# Altium project KPT1001S.PrjPCB
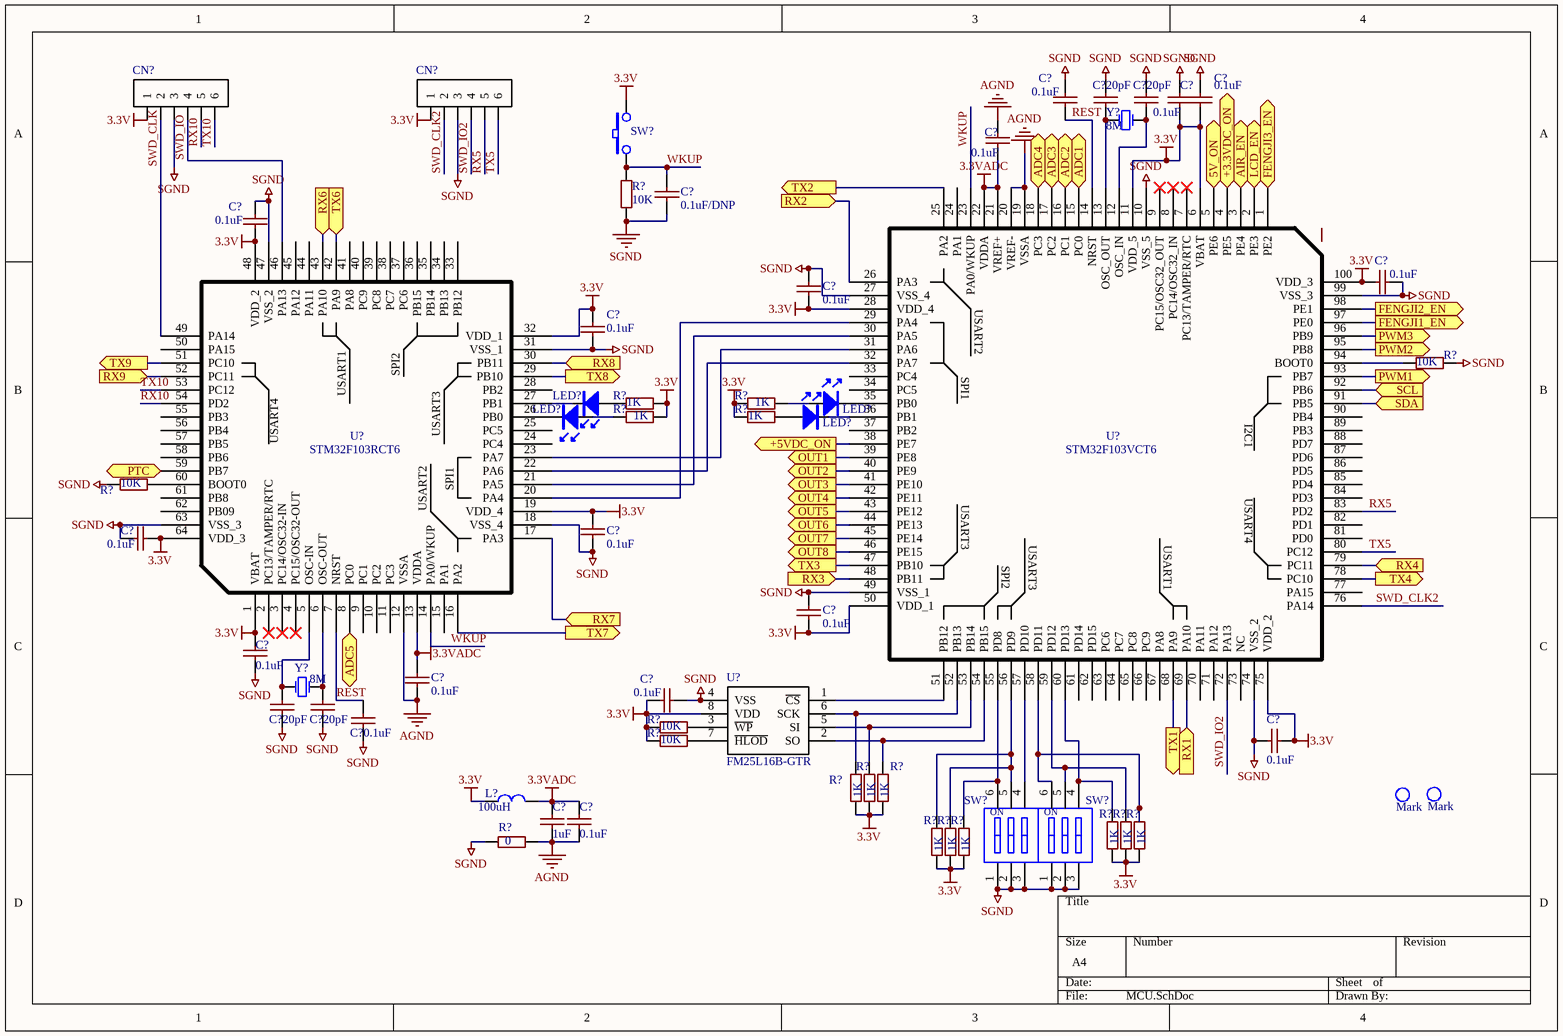
[diagram p0: MCU.SchDoc]
4 sheets, 340 parts. Net scope: flat (ports and power ports of the same name join across sheets).
Sheets:
  MCU.SchDoc
  POWER.SchDoc
  COMM.SchDoc
  OTHER.SchDoc

## Sheet MCU.SchDoc
size A4

### Parts
(Parts that share a designator on the sheet are numbered #1, #2 ... from top to bottom, then left to right.)
C?#1  0.1uF  [0603_C]
C?#2  20pF  [0603_C]
C?#3  20pF  [0603_C]
C?#4  0.1uF  [0603_C]
C?#5  0.1uF  [0603_C]
C?#6  0.1uF  [0603_C]
C?#7  0.1uF/DNP  [0603_C]
C?#8  0.1uF  [0603_C]
C?#9  0.1uF  [0603_C]
C?#10  0.1uF  [0603_C]
C?#11  0.1uF  [0603_C]
C?#12  0.1uF  [0603_C]
C?#13  0.1uF  [0603_C]
C?#14  0.1uF  [0603_C]
C?#15  0.1uF  [0603_C]
C?#16  0.1uF  [0603_C]
C?#17  0.1uF  [0603_C]
C?#18  20pF  [0603_C]
C?#19  20pF  [0603_C]
C?#20  0.1uF  [0603_C]
C?#21  0.1uF  [0603_C]
C?#22  1uF  [0603_C]
C?#23  0.1uF  [0603_C]
CN?#1  CON6  [CON6]  (value not drawn)
CN?#2  CON6  [CON6]  (value not drawn)
L?#1  100uH  [0603_L]
LED?#1  Led  [0603_LED]  (value not drawn)
LED?#2  Led  [0603_LED]  (value not drawn)
LED?#3  Led  [0603_LED]  (value not drawn)
LED?#4  Led  [0603_LED]  (value not drawn)
M?#1  Mark  [Mark]
M?#2  Mark  [Mark]
R?#1  10K  [0603_R]
R?#2  10K  [0603_R]
R?#3  1K  [0603_R]
R?#4  1K  [0603_R]
R?#5  1K  [0603_R]
R?#6  1K  [0603_R]
R?#7  10K  [0603_R]
R?#8  10K  [0603_R]
R?#9  10K  [0603_R]
R?#10  1K  [0603_R]
R?#11  1K  [0603_R]
R?#12  1K  [0603_R]
R?#13  1K  [0603_R]
R?#14  1K  [0603_R]
R?#15  1K  [0603_R]
R?#16  0  [0603_R]
R?#17  1K  [0603_R]
R?#18  1K  [0603_R]
R?#19  1K  [0603_R]
SW?#1  Button  [SW2_12x12]  (value not drawn)
SW?#2  DSHP02TSGET  [DSHP02TSGET]  (value not drawn)
SW?#3  DSHP02TSGET  [DSHP02TSGET]  (value not drawn)
U?#1  STM32F103VCT6  [LQFP100]
U?#2  STM32F103RCT6  [LQFP64]
U?#3  FM25L16B-GTR  [SO8]
Y?#1  8M  [SMD_5032_4p]
Y?#2  8M  [SMD_5032_4p]

### Ports
5V_ON (out), +3.3VDC_ON (out), +5VDC_ON (out), ADC1 (in), ADC2 (in), ADC3 (in), ADC4 (in), ADC5 (in), AIR_EN (out), FENGJI1_EN (out), FENGJI2_EN (out), FENGJI3_EN (out), LCD_EN (out), OUT1 (out), OUT2 (out), OUT3 (out), OUT4 (out), OUT5 (out), OUT6 (out), OUT7 (out), OUT8 (out), PTC (out), PWM1 (out), PWM2 (out), PWM3 (out), RX1 (in), RX2 (in), RX3 (in), RX4 (in), RX6 (in), RX7 (in), RX8 (in), RX9 (in), SCL (in), SDA (in), TX1 (out), TX2 (out), TX3 (out), TX4 (out), TX6 (in), TX7 (out), TX8 (out), TX9 (out)

### Nets
3.3V: C?#4.2 C?#5.2 C?#8.2 C?#9.2 C?#10.2 C?#11.1 C?#12.1 C?#13.2 C?#14.2 C?#15.2 C?#17.1 C?#21.1 CN?#1.1 CN?#2.1 L?#1.1 R?#3.2 R?#4.2 R?#5.2 R?#6.2 R?#8.2 R?#9.2 R?#10.1 R?#11.1 R?#12.1 R?#13.1 R?#14.1 R?#15.1 R?#17.1 R?#18.1 R?#19.1 SW?#1.2 U?#1.6(VBAT) U?#1.11(VDD_5) U?#1.28(VDD_4) U?#1.50(VDD_1) U?#1.75(VDD_2) U?#1.100(VDD_3) U?#2.1(VBAT) U?#2.19(VDD_4) U?#2.32(VDD_1) U?#2.48(VDD_2) U?#2.64(VDD_3) U?#3.8(VDD)
3.3VADC: C?#6.1 C?#16.2 C?#22.2 C?#23.2 L?#1.2 U?#1.21(VREF+) U?#1.22(VDDA) U?#2.13(VDDA)
AGND: C?#6.2 C?#16.1 C?#22.1 C?#23.1 R?#16.1 U?#1.19(VSSA) U?#1.20(VREF-) U?#2.12(VSSA)
SGND: C?#1.1 C?#2.1 C?#3.1 C?#4.1 C?#5.1 C?#7.1 C?#8.1 C?#9.1 C?#10.1 C?#11.2 C?#12.2 C?#13.1 C?#14.1 C?#15.1 C?#17.2 C?#18.2 C?#19.2 C?#20.1 C?#21.2 CN?#1.3 CN?#2.3 R?#1.2 R?#2.1 R?#7.2 R?#16.2 SW?#2.1(A1) SW?#2.2(A2) SW?#2.3(B2) SW?#3.1(A1) SW?#3.2(A2) SW?#3.3(B2) U?#1.10(VSS_5) U?#1.27(VSS_4) U?#1.49(VSS_1) U?#1.74(VSS_2) U?#1.99(VSS_3) U?#2.18(VSS_4) U?#2.31(VSS_1) U?#2.47(VSS_2) U?#2.63(VSS_3) U?#3.4(VSS)
REST: C?#1.2 C?#20.2 U?#1.14(NRST) U?#2.7(NRST)
RX5: CN?#2.5 U?#1.83(PD2)
RX10: CN?#1.5 U?#2.54(PD2)
SWD_CLK: CN?#1.2 U?#2.49(PA14)
SWD_CLK2: CN?#2.2 U?#1.76(PA14)
SWD_IO: CN?#1.4 U?#2.46(PA13)
SWD_IO2: CN?#2.4 U?#1.72(PA13)
TX5: CN?#2.6 U?#1.80(PC12)
TX10: CN?#1.6 U?#2.53(PC12)
WKUP: C?#7.2 R?#1.1 SW?#1.1 U?#1.23(PA0/WKUP) U?#2.14(PA0/WKUP)
NetC?#2_2: C?#2.2 U?#1.13(OSC_OUT) Y?#1.1(OSC1)
NetC?#3_2: C?#3.2 U?#1.12(OSC_IN) Y?#1.3(OSC2)
NetC?#18_1: C?#18.1 U?#2.5(OSC-IN) Y?#2.3(OSC2)
NetC?#19_1: C?#19.1 U?#2.6(OSC-OUT) Y?#2.1(OSC1)
NetC?#66_1: U?#1.15(PC0) ; port ADC1
NetC?#67_1: U?#1.16(PC1) ; port ADC2
NetC?#68_1: U?#1.17(PC2) ; port ADC3
NetC?#69_1: U?#1.18(PC3) ; port ADC4
NetC?#70_1: U?#2.8(PC0) ; port ADC5
NetLED?#1_A: LED?#1.A R?#4.1
NetLED?#1_K: LED?#1.K U?#1.35(PB0)
NetLED?#2_A: LED?#2.A R?#6.1
NetLED?#2_K: LED?#2.K U?#1.36(PB1)
NetLED?#3_A: LED?#3.A R?#3.1
NetLED?#3_K: LED?#3.K U?#2.27(PB1)
NetLED?#4_A: LED?#4.A R?#5.1
NetLED?#4_K: LED?#4.K U?#2.26(PB0)
NetLED?#9_K: U?#1.48(PB11) ; port RX3
NetLED?#10_K: U?#1.79(PC11) ; port RX4
NetR?#2_2: R?#2.2 U?#1.94(BOOT0)
NetR?#7_1: R?#7.1 U?#2.60(BOOT0)
NetR?#8_1: R?#8.1 U?#3.3(~{WP})
NetR?#9_1: R?#9.1 U?#3.7(~{HLOD})
NetR?#10_2: R?#10.2 U?#1.52(PB13) U?#3.6(SCK)
NetR?#11_2: R?#11.2 U?#1.53(PB14) U?#3.5(SI)
NetR?#12_2: R?#12.2 U?#1.54(PB15) U?#3.2(SO)
NetR?#13_2: R?#13.2 SW?#3.4(B1) U?#1.60(PD13)
NetR?#14_2: R?#14.2 SW?#3.5(B2) U?#1.59(PD12)
NetR?#15_2: R?#15.2 SW?#3.6(B3) U?#1.58(PD11)
NetR?#17_2: R?#17.2 R?#18.2 SW?#2.5(B2) U?#1.56(PD9)
NetR?#19_2: R?#19.2 SW?#2.6(B3) U?#1.55(PD8)
NetR?#22_1: U?#1.44(PE13) ; port OUT6
NetR?#25_1: U?#1.45(PE14) ; port OUT7
NetR?#28_1: U?#1.46(PE15) ; port OUT8
NetR?#31_1: U?#1.4(PE5) ; port +3.3VDC_ON
NetR?#36_1: U?#1.38(PE7) ; port +5VDC_ON
NetR?#37_1: U?#1.5(PE6) ; port 5V_ON
NetR?#43_1: U?#2.59(PB7) ; port PTC
NetR?#68_1: U?#1.91(PB5) ; port SDA
NetR?#69_1: U?#1.92(PB6) ; port SCL
NetR?#79_2: U?#1.93(PB7) ; port PWM1
NetR?#82_2: U?#1.39(PE8) ; port OUT1
NetR?#87_2: U?#1.95(PB8) ; port PWM2
NetR?#91_2: U?#1.40(PE9) ; port OUT2
NetR?#95_2: U?#1.96(PB9) ; port PWM3
NetR?#99_2: U?#1.41(PE10) ; port OUT3
NetR?#106_2: U?#1.42(PE11) ; port OUT4
NetR?#110_2: U?#1.43(PE12) ; port OUT5
NetSW?#2_4: SW?#2.4(B1) U?#1.57(PD10)
NetU?#1_1: U?#1.1(PE2) ; port FENGJI3_EN
NetU?#1_2: U?#1.2(PE3) ; port LCD_EN
NetU?#1_3: U?#1.3(PE4) ; port AIR_EN
NetU?#1_25: U?#1.25(PA2) ; port TX2
NetU?#1_26: U?#1.26(PA3) ; port RX2
NetU?#1_29: U?#1.29(PA4) U?#2.20(PA4)
NetU?#1_30: U?#1.30(PA5) U?#2.21(PA5)
NetU?#1_31: U?#1.31(PA6) U?#2.23(PA7)
NetU?#1_32: U?#1.32(PA7) U?#2.22(PA6)
NetU?#1_47: U?#1.47(PB10) ; port TX3
NetU?#1_51: U?#1.51(PB12) U?#3.1(~{CS})
NetU?#1_68: U?#1.68(PA9) ; port TX1
NetU?#1_69: U?#1.69(PA10) ; port RX1
NetU?#1_78: U?#1.78(PC10) ; port TX4
NetU?#1_97: U?#1.97(PE0) ; port FENGJI1_EN
NetU?#1_98: U?#1.98(PE1) ; port FENGJI2_EN
NetU?#2_16: U?#2.16(PA2) ; port TX7
NetU?#2_17: U?#2.17(PA3) ; port RX7
NetU?#2_29: U?#2.29(PB10) ; port TX8
NetU?#2_30: U?#2.30(PB11) ; port RX8
NetU?#2_42: U?#2.42(PA9) ; port TX6
NetU?#2_43: U?#2.43(PA10) ; port RX6
NetU?#2_51: U?#2.51(PC10) ; port TX9
NetU?#2_52: U?#2.52(PC11) ; port RX9

Not connected (* = marked no-connect by the designer): U?#1 7(PC13/TAMPER/RTC)* 8(PC14/OSC32_IN)* 9(PC15/OSC32_OUT)* 24(PA1) 33(PC4) 34(PC5) 37(PB2) 61(PD14) 62(PD15) 63(PC6) 64(PC7) 65(PC8) 66(PC9) 67(PA8) 70(PA11) 71(PA12) 73(NC) 77(PA15) 81(PD0) 82(PD1) 84(PD3) 85(PD4) 86(PD5) 87(PD6) 88(PD7) 89(PB3) 90(PB4); U?#2 2(PC13/TAMPER/RTC)* 3(PC14/OSC32-IN)* 4(PC15/OSC32-OUT)* 9(PC1) 10(PC2) 11(PC3) 15(PA1) 24(PC4) 25(PC5) 28(PB2) 33(PB12) 34(PB13) 35(PB14) 36(PB15) 37(PC6) 38(PC7) 39(PC8) 40(PC9) 41(PA8) 44(PA11) 45(PA12) 50(PA15) 55(PB3) 56(PB4) 57(PB5) 58(PB6) 61(PB8) 62(PB09); Y?#1 2 4; Y?#2 2 4

### Notes on the sheet
- (in symbol STM32F103RXXX) SPI2; USART1; USART3; USART4; SPI1; USART2
- (in symbol STM32F103VXXX) USART2; SPI1; I2C1; USART4; USART3; USART1; SPI2
- (in symbol 拨码开关) ON

### Library data of the parts
C?#1 C?#4-C?#17 C?#20 C?#21 C?#23 = CAP: 电容; 三星: CL10B104JB8NNNC; 风华: 0603B104J500NT
C?#2 C?#3 C?#18 C?#19 = CAP: 电容; 风华: 0603CG200J500NT; 三星: CL10C200JB8NNNC
C?#22 = CAP: 电容; 三星: CL10A105KP8NNNC; 风华: 0603X105K100NT
CN?#1 CN?#2 = CON6: 连接器
L?#1 = Inductor: 电感
LED?#1-LED?#4 = Led: 发光二极管
M?#1 M?#2 = Mark: 标识点
R?#1-R?#9 = RES: 电阻; 厚生: 0603WAF1002T5E; 风华: RS-03K103FT
R?#10-R?#15 R?#17-R?#19 = RES: 电阻
R?#16 = RES: 电阻; 厚生: 0603WAF0000T5E; 风华: RS-03K000FT
SW?#1 = Button: 按键12*12*7.3
SW?#2 SW?#3 = 拨码开关
U?#1 = STM32F103VXXX: 单片机; 意法: STM32F103VCT6
U?#2 = STM32F103RXXX: STM32 64Pin
U?#3 = FM25: FRAM存储器
Y?#1 Y?#2 = 贴装晶振: Crystal Oscillator; 雅晶: 5032-SMD8.000M20PF

## Sheet POWER.SchDoc
size A4
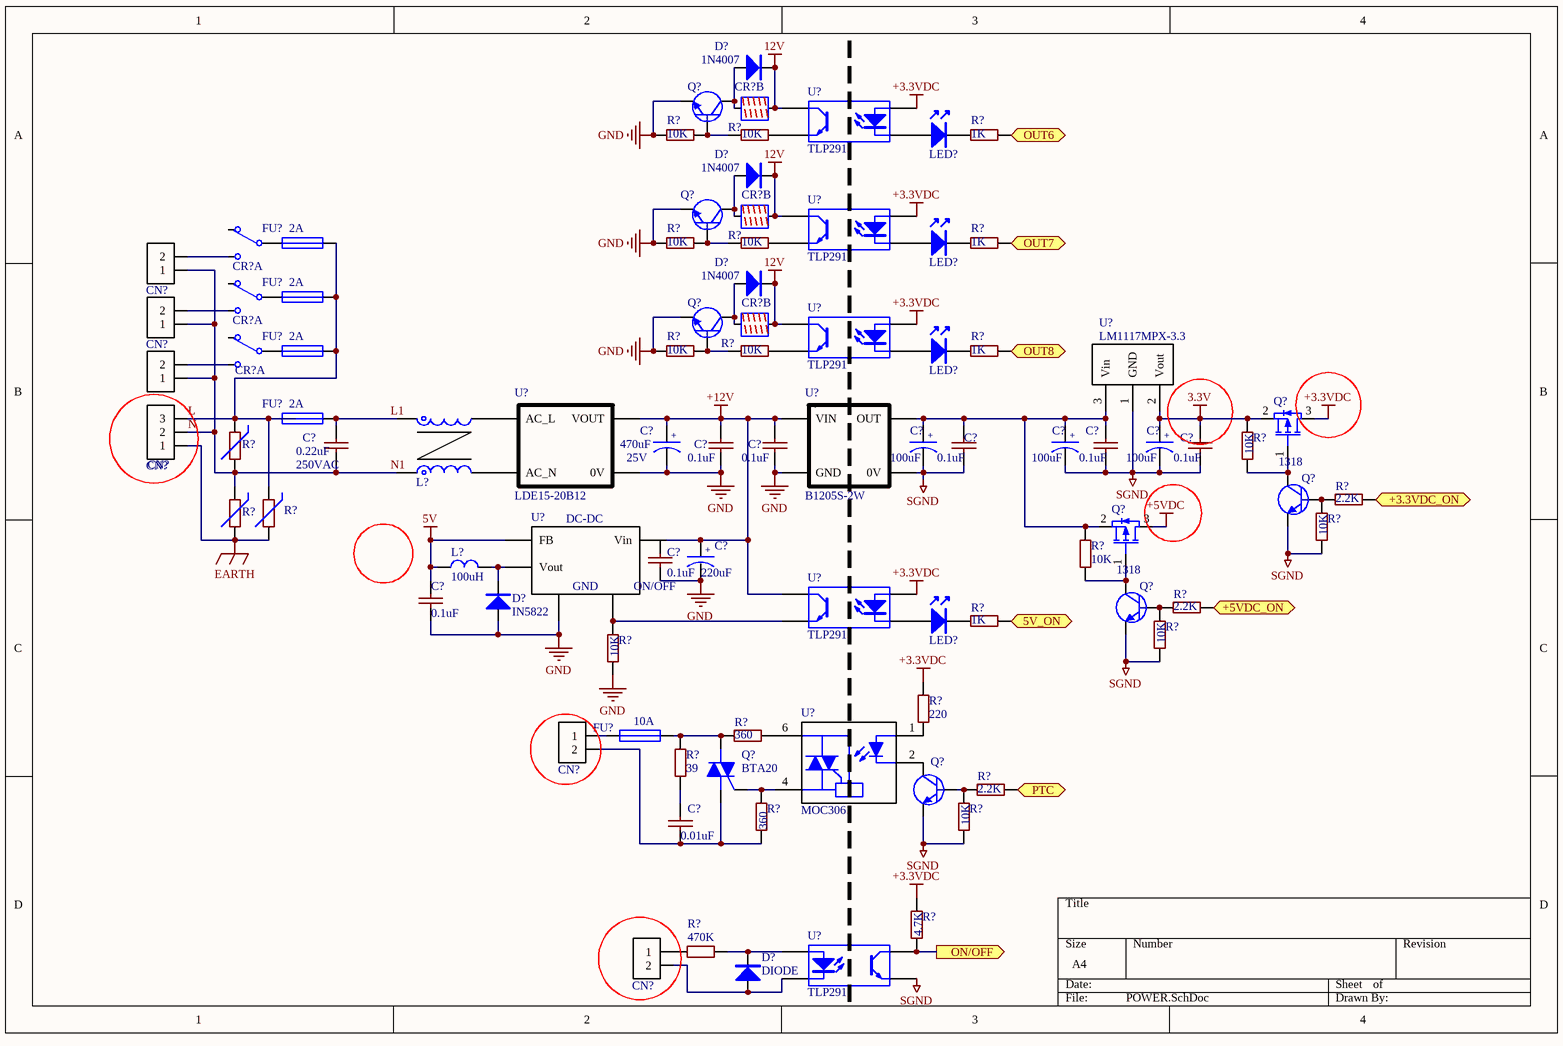
[diagram p1: POWER.SchDoc]

### Parts
(Parts that share a designator on the sheet are numbered #1, #2 ... from top to bottom, then left to right.)
C?#24  470uF  [HONOR_10X105]
C?#25  100uF  [HONOR_63X54]
C?#26  100uF  [HONOR_63X54]
C?#27  100uF  [HONOR_63X54]
C?#28  0.22uF  耐压: 250VAC  [0603_C]
C?#29  0.1uF  [0603_C]
C?#30  0.1uF  [0603_C]
C?#31  0.1uF  [0603_C]
C?#32  0.1uF  [0603_C]
C?#33  0.1uF  [0603_C]
C?#34  220uF  [HONOR_63X54]
C?#35  0.1uF  [0603_C]
C?#36  0.1uF  [0603_C]
C?#37  0.01uF  [0603_C]
CN?#3  CON2  [WJ128V-2P]  (value not drawn)
CN?#4  CON2  [WJ128V-2P]  (value not drawn)
CN?#5  CON2  [WJ128V-2P]  (value not drawn)
CN?#6  CON3  [HB9500-3P]  (value not drawn)
CN?#7  CON2  [HB9500-2P]  (value not drawn)
CN?#8  CON2  [HB9500-2P]  (value not drawn)
CR?#1  继电器  [G5Q-14]  (value not drawn)  (part B of 2)
CR?#2  继电器  [G5Q-14]  (value not drawn)  (part B of 2)
CR?#3  继电器  [G5Q-14]  (value not drawn)  (part A of 2)
CR?#4  继电器  [G5Q-14]  (value not drawn)  (part A of 2)
CR?#5  继电器  [G5Q-14]  (value not drawn)  (part B of 2)
CR?#6  继电器  [G5Q-14]  (value not drawn)  (part A of 2)
D?#1  1N4007  [MUR]
D?#2  1N4007  [MUR]
D?#3  1N4007  [MUR]
D?#4  IN5822  [二极管SOD-123]
D?#5  DIODE  [MUR]
FU?#1  2A  [BX]
FU?#2  2A  [BX]
FU?#3  2A  [BX]
FU?#4  2A  [BX]
FU?#5  10A  [BX]
L?#2  共模电感  [FL2D-Z5-103]  (value not drawn)
L?#3  100uH  [0603_L]
LED?#5  Led  [0603_LED]  (value not drawn)
LED?#6  Led  [0603_LED]  (value not drawn)
LED?#7  Led  [0603_LED]  (value not drawn)
LED?#8  Led  [0603_LED]  (value not drawn)
Q?#1  1318  [SOT-23]  (value not drawn)
Q?#2  1318  [SOT-23]  (value not drawn)
Q?#3  1318  [SOT-23]  (value not drawn)
Q?#4  MOS_P  [SOT-23]  (value not drawn)
Q?#5  1318  [SOT-23]
Q?#6  MOS_P  [SOT-23]  (value not drawn)
Q?#7  1318  [SOT-23]
Q?#8  BTA20
Q?#9  1318  [SOT-23]  (value not drawn)
R?#20  10K  [0603_R]
R?#21  10K  [0603_R]
R?#22  1K  [0603_R]
R?#23  10K  [0603_R]
R?#24  10K  [0603_R]
R?#25  1K  [0603_R]
R?#26  10K  [0603_R]
R?#27  10K  [0603_R]
R?#28  1K  [0603_R]
R?#29  431K10D  [RAD0.2]  (value not drawn)
R?#30  10K  [1206_R]
R?#31  2.2K  [1206_R]
R?#32  431K10D  [RAD0.2]  (value not drawn)
R?#33  431K10D  [RAD0.2]  (value not drawn)
R?#34  10K  [1206_R]
R?#35  10K  [1206_R]
R?#36  2.2K  [1206_R]
R?#37  1K  [1206_R]
R?#38  10K  [1206_R]
R?#39  10K  [1206_R]
R?#40  220  [1206_R]
R?#41  360  [1206_R]
R?#42  39  [1206_R]
R?#43  2.2K  [1206_R]
R?#44  360  [1206_R]
R?#45  10K  [1206_R]
R?#46  4.7K  [1206_R]
R?#47  470K  [0603_R]
U?#4  TLP291  [sop-4]
U?#5  TLP291  [sop-4]
U?#6  TLP291  [sop-4]
U?#7  LM1117MPX-3.3  [SOT-223]
U?#8  LDE15-20B12  [LDE15]
U?#9  B1205S-2W  [DCDC-BS2W]
U?#10  DC-DC  [TO-263-5L]
U?#11  TLP291  [sop-4]
U?#12  MOC3061  [SMT-6PIN]
U?#13  TLP291  [sop-4]

### Ports
5V_ON (in), +3.3VDC_ON (in), +5VDC_ON (in), ON/OFF (out), OUT6 (in), OUT7 (in), OUT8 (in), PTC (out)

### Nets
3.3V: C?#27.1 C?#33.1 Q?#4.2(S) R?#30.1 U?#7.2(Vout)
5V: C?#36.1 L?#3.2 U?#10.4(FB)
12V: CR?#1.1 CR?#2.1 CR?#5.1 D?#1.K D?#2.K D?#3.K U?#4.4 U?#5.4 U?#6.4
+3.3VDC: Q?#4.3(D) R?#40.2 R?#46.2 U?#4.1 U?#5.1 U?#6.1 U?#11.1
+5VDC: Q?#6.3(D)
+12V: C?#24.1 C?#29.1 C?#30.1 C?#34.1 U?#8.4(VOUT) U?#9.1(VIN) U?#10.1(Vin) U?#11.4
EARTH: CN?#6.1 R?#32.1 R?#33.1
GND: C?#24.2 C?#29.2 C?#30.2 C?#34.2 C?#35.2 C?#36.2 D?#4.A Q?#1.2(E) Q?#2.2(E) Q?#3.2(E) R?#20.2 R?#23.2 R?#26.2 R?#39.2 U?#8.3(0V) U?#9.2(GND) U?#10.3(GND)
SGND: C?#25.2 C?#26.2 C?#27.2 C?#31.2 C?#32.2 C?#33.2 Q?#5.2(E) Q?#7.2(E) Q?#9.2(E) R?#34.1 R?#38.1 R?#45.1 U?#7.1(GND) U?#9.4(0V) U?#13.3
L: CN?#6.3 FU?#1.2 FU?#2.2 FU?#3.2 FU?#4.1 R?#29.2 R?#33.2
L1: C?#28.1 FU?#4.2 L?#2.1
N: C?#28.2 CN?#3.1 CN?#4.1 CN?#5.1 CN?#6.2 L?#2.2 R?#29.1 R?#32.2  [also labelled N1]
NetC?#25_1: C?#25.1 C?#26.1 C?#31.1 C?#32.1 Q?#6.2(S) R?#35.1 U?#7.3(Vin) U?#9.6(OUT)
NetC?#37_1: C?#37.1 R?#42.1
NetC?#37_2: C?#37.2 CN?#7.2 Q?#8.1(A1) R?#44.1
NetCN?#3_2: CN?#3.2 CR?#3.3
NetCN?#4_2: CN?#4.2 CR?#4.3
NetCN?#5_2: CN?#5.2 CR?#6.3
NetCN?#7_1: CN?#7.1 FU?#5.1
NetCN?#8_1: CN?#8.1 R?#47.2
NetCN?#8_2: CN?#8.2 D?#5.A U?#13.2
NetCR?#1_5: CR?#1.5 D?#1.A Q?#1.3(C)
NetCR?#2_5: CR?#2.5 D?#2.A Q?#2.3(C)
NetCR?#3_4: CR?#3.4 FU?#1.1
NetCR?#4_4: CR?#4.4 FU?#2.1
NetCR?#5_5: CR?#5.5 D?#3.A Q?#3.3(C)
NetCR?#6_4: CR?#6.4 FU?#3.1
NetD?#4_K: D?#4.K L?#3.1 U?#10.2(Vout)
NetD?#5_K: D?#5.K R?#47.1 U?#13.1
NetFU?#5_2: FU?#5.2 Q?#8.2(A2) R?#41.2 R?#42.2
NetL?#2_3: L?#2.3 U?#8.1(AC_N)
NetL?#2_4: L?#2.4 U?#8.2(AC_L)
NetLED?#5_A: LED?#5.A U?#4.2
NetLED?#5_K: LED?#5.K R?#22.2
NetLED?#6_A: LED?#6.A U?#5.2
NetLED?#6_K: LED?#6.K R?#25.2
NetLED?#7_A: LED?#7.A U?#6.2
NetLED?#7_K: LED?#7.K R?#28.2
NetLED?#8_A: LED?#8.A U?#11.2
NetLED?#8_K: LED?#8.K R?#37.2
NetQ?#1_1: Q?#1.1(B) R?#20.1 R?#21.2
NetQ?#2_1: Q?#2.1(B) R?#23.1 R?#24.2
NetQ?#3_1: Q?#3.1(B) R?#26.1 R?#27.2
NetQ?#4_1: Q?#4.1(G) Q?#5.3(C) R?#30.2
NetQ?#5_1: Q?#5.1(B) R?#31.2 R?#34.2
NetQ?#6_1: Q?#6.1(G) Q?#7.3(C) R?#35.2
NetQ?#7_1: Q?#7.1(B) R?#36.2 R?#38.2
NetQ?#8_3: Q?#8.3(G) R?#44.2 U?#12.4(MT)
NetQ?#9_1: Q?#9.1(B) R?#43.2 R?#45.2
NetQ?#9_3: Q?#9.3(C) U?#12.2(CATHODE)
NetR?#21_1: R?#21.1 U?#4.3
NetR?#22_1: R?#22.1 ; port OUT6
NetR?#24_1: R?#24.1 U?#5.3
NetR?#25_1: R?#25.1 ; port OUT7
NetR?#27_1: R?#27.1 U?#6.3
NetR?#28_1: R?#28.1 ; port OUT8
NetR?#31_1: R?#31.1 ; port +3.3VDC_ON
NetR?#36_1: R?#36.1 ; port +5VDC_ON
NetR?#37_1: R?#37.1 ; port 5V_ON
NetR?#39_1: R?#39.1 U?#10.5(ON/OFF) U?#11.3
NetR?#40_1: R?#40.1 U?#12.1(ANODE)
NetR?#41_1: R?#41.1 U?#12.6(MT)
NetR?#43_1: R?#43.1 ; port PTC
NetR?#46_1: R?#46.1 U?#13.4 ; port ON/OFF

Not connected (* = marked no-connect by the designer): C?#35 1; CR?#3 2; CR?#4 2; CR?#6 2; U?#12 3(N/C) 5(N/C)

### Notes on the sheet
- (in symbol CAP  POL) +; 25V

### Library data of the parts
C?#24 = CAP  POL: 电解电容; 松下: EEEFC1E471P
C?#25-C?#27 = CAP  POL: 电解电容; 松下: EEEHAA101WAP
C?#28-C?#33 C?#35 C?#36 = CAP: 电容; 风华: 0603CG200J500NT; 三星: CL10C200JB8NNNC; 三星: CL10B104JB8NNNC; 风华: 0603B104J500NT
C?#34 = CAP  POL: 电解电容; 松下: EEEHAA221WAP
C?#37 = CAP: 电容
CN?#3-CN?#5 CN?#7 CN?#8 = CON2: 连接器; KANGNEX(康奈克斯电气): HB9500-2P 黑色
CN?#6 = CON3: 连接器
D?#1-D?#5 = DIODE: 二极管
FU?#1-FU?#5 = FUSE1: 保险
L?#2 = 共模电感: 电感; 金升阳: FL2D-Z5-103
L?#3 = Inductor: 电感
LED?#5-LED?#8 = Led: 发光二极管
Q?#1-Q?#3 Q?#5 Q?#7 Q?#9 = NPN: 三极管
Q?#8 = BTAXX: ST(意法半导体): BTA20-600CWRG
R?#20-R?#28 R?#47 = RES: 电阻
R?#29 R?#32 R?#33 = 压敏电阻
R?#30 R?#31 R?#34-R?#41 R?#43-R?#46 = RES: 电阻; 风华: RS-06K3600FT
R?#42 = RES: 电阻; 风华: RS-06K390JT
U?#7 = LM1117MPX-3.3: LM1117 3.3V固定输出
U?#8 = LDE15-20B12: 220转12V AC模块
U?#9 = B1205S-2W: 12V转5V电源隔离模块
U?#10 = LM2576: 降压模块3A
U?#12 = MOC3061: ON(安森美): MOC3061SR2M
CR?#1-CR?#6 = 继电器: Published: 24-Mar-1999; LatestRevisionDate: 17-Jul-2002; LatestRevisionNote: Re-released for DXP Platform.; PackageReference: DIP-P8; Publisher: Altium Limited

## Sheet COMM.SchDoc
size A4
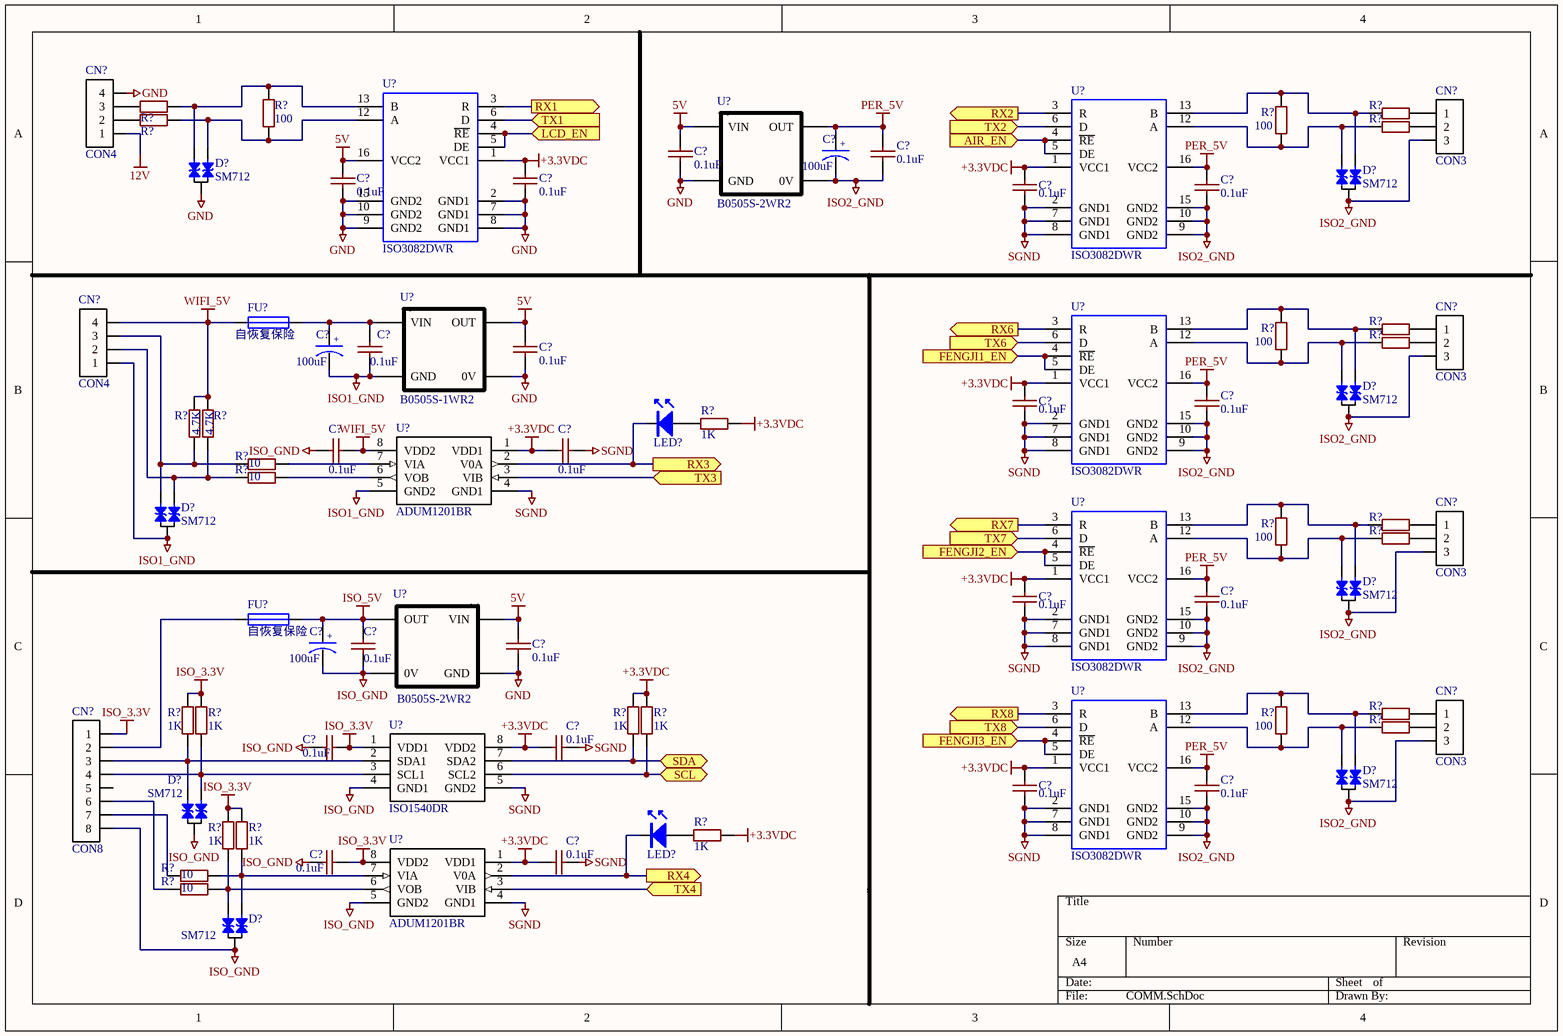
[diagram p2: COMM.SchDoc]

### Parts
(Parts that share a designator on the sheet are numbered #1, #2 ... from top to bottom, then left to right.)
C?#38  100uF  [HONOR_63X54]
C?#39  0.1uF  [0603_C]
C?#40  0.1uF  [0603_C]
C?#41  0.1uF  [0603_C]
C?#42  0.1uF  [0603_C]
C?#43  0.1uF  [0603_C]
C?#44  0.1uF  [0603_C]
C?#45  100uF  [HONOR_63X54]
C?#46  0.1uF  [0603_C]
C?#47  0.1uF  [0603_C]
C?#48  0.1uF  [0603_C]
C?#49  0.1uF  [0603_C]
C?#50  0.1uF  [0603_C]
C?#51  0.1uF  [0603_C]
C?#52  0.1uF  [0603_C]
C?#53  0.1uF  [0603_C]
C?#54  100uF  [HONOR_63X54]
C?#55  0.1uF  [0603_C]
C?#56  0.1uF  [0603_C]
C?#57  0.1uF  [0603_C]
C?#58  0.1uF  [0603_C]
C?#59  0.1uF  [0603_C]
C?#60  0.1uF  [0603_C]
C?#61  0.1uF  [0603_C]
C?#62  0.1uF  [0603_C]
CN?#9  CON3  [HB9500-3P]
CN?#10  CON4
CN?#11  CON3  [HB9500-3P]
CN?#12  CON4
CN?#13  CON3  [HB9500-3P]
CN?#14  CON3  [HB9500-3P]
CN?#15  CON8
D?#6  SM712  [SOT-23]
D?#7  SM712  [SOT-23]
D?#8  SM712  [SOT-23]
D?#9  SM712  [SOT-23]
D?#10  SM712  [SOT-23]
D?#11  SM712  [SOT-23]
D?#12  SM712  [SOT-23]
D?#13  SM712  [SOT-23]
FU?#6  自恢复保险  [BX]
FU?#7  自恢复保险  [BX]
LED?#9  Led  [0603_LED]  (value not drawn)
LED?#10  Led  [0603_LED]  (value not drawn)
R?#48  RES  [0603_R]  (value not drawn)
R?#49  100  [0603_R]
R?#50  RES  [0603_R]  (value not drawn)
R?#51  RES  [0603_R]  (value not drawn)
R?#52  100  [0603_R]
R?#53  RES  [0603_R]  (value not drawn)
R?#54  RES  [0603_R]  (value not drawn)
R?#55  100  [0603_R]
R?#56  RES  [0603_R]  (value not drawn)
R?#57  4.7K  [1206_R]
R?#58  4.7K  [1206_R]
R?#59  1K  [1206_R]
R?#60  10  [0603_R]
R?#61  10  [0603_R]
R?#62  RES  [0603_R]  (value not drawn)
R?#63  100  [0603_R]
R?#64  RES  [0603_R]  (value not drawn)
R?#65  RES  [0603_R]  (value not drawn)
R?#66  1K  [1206_R]
R?#67  1K  [1206_R]
R?#68  1K  [1206_R]
R?#69  1K  [1206_R]
R?#70  100  [0603_R]
R?#71  RES  [0603_R]  (value not drawn)
R?#72  1K  [1206_R]
R?#73  1K  [1206_R]
R?#74  1K  [1206_R]
R?#75  10  [0603_R]
R?#76  10  [0603_R]
U?#14  ISO3082DWR  [SOIC_16]
U?#15  ISO3082DWR  [SOIC_16]
U?#16  B0505S-2WR2  [DCDC-BS2W]
U?#17  B0505S-1WR2  [B0505S_1W]
U?#18  ISO3082DWR  [SOIC_16]
U?#19  ADUM1201BR  [SOIC127P600X175-8M]
U?#20  ISO3082DWR  [SOIC_16]
U?#21  B0505S-2WR2  [DCDC-BS2W]
U?#22  ISO3082DWR  [SOIC_16]
U?#23  ISO1540DR  [SO8]
U?#24  ADUM1201BR  [SOIC127P600X175-8M]

### Ports
AIR_EN (in), FENGJI1_EN (in), FENGJI2_EN (in), FENGJI3_EN (in), LCD_EN (in), RX1 (out), RX2 (out), RX3 (out), RX4 (out), RX6 (out), RX7 (out), RX8 (out), SCL, SDA, TX1 (in), TX2 (in), TX3 (in), TX4 (in), TX6 (in), TX7 (in), TX8 (in)

### Nets
5V: C?#39.2 C?#41.2 C?#47.2 C?#56.2 U?#14.16(VCC2) U?#16.1(VIN) U?#17.4(OUT) U?#21.1(VIN)
12V: CN?#10.1
+3.3VDC: C?#42.2 C?#43.2 C?#48.2 C?#51.2 C?#52.2 C?#58.2 C?#59.2 C?#62.2 R?#59.2 R?#68.2 R?#69.2 R?#74.2 U?#14.1(VCC1) U?#15.1(VCC1) U?#18.1(VCC1) U?#19.1(VDD1) U?#20.1(VCC1) U?#22.1(VCC1) U?#23.8(VDD2) U?#24.1(VDD1)
GND: C?#39.1 C?#41.1 C?#42.1 C?#47.1 C?#56.1 CN?#10.4 D?#6.3 U?#14.2(GND1) U?#14.7(GND1) U?#14.8(GND1) U?#14.9(GND2) U?#14.10(GND2) U?#14.15(GND2) U?#16.2(GND) U?#17.3(0V) U?#21.2(GND)
ISO1_GND: C?#45.2 C?#46.1 CN?#12.1 D?#9.3 U?#17.1(GND) U?#19.5(GND2)
ISO2_GND: C?#38.2 C?#40.1 C?#44.1 C?#49.1 C?#53.1 C?#60.1 CN?#9.3 CN?#11.3 CN?#13.3 CN?#14.3 D?#7.3 D?#8.3 D?#10.3 D?#11.3 U?#15.9(GND2) U?#15.10(GND2) U?#15.15(GND2) U?#16.4(0V) U?#18.9(GND2) U?#18.10(GND2) U?#18.15(GND2) U?#20.9(GND2) U?#20.10(GND2) U?#20.15(GND2) U?#22.9(GND2) U?#22.10(GND2) U?#22.15(GND2)
ISO_3.3V: C?#57.1 C?#61.1 CN?#15.1 R?#66.2 R?#67.2 R?#72.2 R?#73.2 U?#23.1(VDD1) U?#24.8(VDD2)
ISO_5V: C?#54.1 C?#55.2 FU?#7.1 U?#21.6(OUT)
ISO_GND: C?#50.2 C?#54.2 C?#55.1 C?#57.2 C?#61.2 CN?#15.8 D?#12.3 D?#13.3 U?#21.4(0V) U?#23.4(GND1) U?#24.5(GND2)
PER_5V: C?#38.1 C?#40.2 C?#44.2 C?#49.2 C?#53.2 C?#60.2 U?#15.16(VCC2) U?#16.6(OUT) U?#18.16(VCC2) U?#20.16(VCC2) U?#22.16(VCC2)
SGND: C?#43.1 C?#48.1 C?#51.1 C?#52.1 C?#58.1 C?#59.1 C?#62.1 U?#15.2(GND1) U?#15.7(GND1) U?#15.8(GND1) U?#18.2(GND1) U?#18.7(GND1) U?#18.8(GND1) U?#19.4(GND1) U?#20.2(GND1) U?#20.7(GND1) U?#20.8(GND1) U?#22.2(GND1) U?#22.7(GND1) U?#22.8(GND1) U?#23.5(GND2) U?#24.4(GND1)
WIFI_5V: C?#50.1 CN?#12.4 FU?#6.2 R?#57.2 R?#58.2 U?#19.8(VDD2)
NetC?#45_1: C?#45.1 C?#46.2 FU?#6.1 U?#17.2(VIN)
NetCN?#9_1: CN?#9.1 R?#50.1
NetCN?#9_2: CN?#9.2 R?#53.1
NetCN?#10_2: CN?#10.2 R?#51.1
NetCN?#10_3: CN?#10.3 R?#48.1
NetCN?#11_1: CN?#11.1 R?#54.1
NetCN?#11_2: CN?#11.2 R?#56.1
NetCN?#12_2: CN?#12.2 D?#9.1 R?#58.1 R?#61.2
NetCN?#12_3: CN?#12.3 D?#9.2 R?#57.1 R?#60.2
NetCN?#13_1: CN?#13.1 R?#62.1
NetCN?#13_2: CN?#13.2 R?#64.1
NetCN?#14_1: CN?#14.1 R?#65.1
NetCN?#14_2: CN?#14.2 R?#71.1
NetCN?#15_2: CN?#15.2 FU?#7.2
NetCN?#15_3: CN?#15.3 D?#12.2 R?#66.1 U?#23.2(SDA1)
NetCN?#15_4: CN?#15.4 D?#12.1 R?#67.1 U?#23.3(SCL1)
NetCN?#15_6: CN?#15.6 R?#76.2
NetCN?#15_7: CN?#15.7 R?#75.2
NetD?#6_1: D?#6.1 R?#48.2 R?#49.2 U?#14.13(B)
NetD?#6_2: D?#6.2 R?#49.1 R?#51.2 U?#14.12(A)
NetD?#7_1: D?#7.1 R?#50.2 R?#52.2 U?#15.13(B)
NetD?#7_2: D?#7.2 R?#52.1 R?#53.2 U?#15.12(A)
NetD?#8_1: D?#8.1 R?#54.2 R?#55.2 U?#18.13(B)
NetD?#8_2: D?#8.2 R?#55.1 R?#56.2 U?#18.12(A)
NetD?#10_1: D?#10.1 R?#62.2 R?#63.2 U?#20.13(B)
NetD?#10_2: D?#10.2 R?#63.1 R?#64.2 U?#20.12(A)
NetD?#11_1: D?#11.1 R?#65.2 R?#70.2 U?#22.13(B)
NetD?#11_2: D?#11.2 R?#70.1 R?#71.2 U?#22.12(A)
NetD?#13_1: D?#13.1 R?#73.1 R?#75.1 U?#24.7(VIA)
NetD?#13_2: D?#13.2 R?#72.1 R?#76.1 U?#24.6(VOB)
NetLED?#9_A: LED?#9.A R?#59.1
NetLED?#9_K: LED?#9.K U?#19.2(V0A) ; port RX3
NetLED?#10_A: LED?#10.A R?#74.1
NetLED?#10_K: LED?#10.K U?#24.2(V0A) ; port RX4
NetR?#60_1: R?#60.1 U?#19.7(VIA)
NetR?#61_1: R?#61.1 U?#19.6(VOB)
NetR?#68_1: R?#68.1 U?#23.7(SDA2) ; port SDA
NetR?#69_1: R?#69.1 U?#23.6(SCL2) ; port SCL
NetU?#1_1: U?#22.4(~{RE}) U?#22.5(DE) ; port FENGJI3_EN
NetU?#1_2: U?#14.4(~{RE}) U?#14.5(DE) ; port LCD_EN
NetU?#1_3: U?#15.4(~{RE}) U?#15.5(DE) ; port AIR_EN
NetU?#1_25: U?#15.6(D) ; port TX2
NetU?#1_26: U?#15.3(R) ; port RX2
NetU?#1_47: U?#19.3(VIB) ; port TX3
NetU?#1_68: U?#14.6(D) ; port TX1
NetU?#1_69: U?#14.3(R) ; port RX1
NetU?#1_78: U?#24.3(VIB) ; port TX4
NetU?#1_97: U?#18.4(~{RE}) U?#18.5(DE) ; port FENGJI1_EN
NetU?#1_98: U?#20.4(~{RE}) U?#20.5(DE) ; port FENGJI2_EN
NetU?#2_16: U?#20.6(D) ; port TX7
NetU?#2_17: U?#20.3(R) ; port RX7
NetU?#2_29: U?#22.6(D) ; port TX8
NetU?#2_30: U?#22.3(R) ; port RX8
NetU?#2_42: U?#18.6(D) ; port TX6
NetU?#2_43: U?#18.3(R) ; port RX6

Not connected (* = marked no-connect by the designer): CN?#15 5; U?#14 11(NC) 14(NC); U?#15 11(NC) 14(NC); U?#18 11(NC) 14(NC); U?#20 11(NC) 14(NC); U?#22 11(NC) 14(NC)

### Notes on the sheet
- (in symbol CAP  POL) +

### Library data of the parts
C?#38 C?#45 C?#54 = CAP  POL: 电解电容; 松下: EEEHAA101WAP
C?#39-C?#44 C?#46-C?#53 C?#55-C?#62 = CAP: as C?#1 on sheet MCU
CN?#9 CN?#11 CN?#13 CN?#14 = CON3: 连接器
CN?#10 CN?#12 = CON4: 连接器
CN?#15 = CON8: 连接器
D?#6-D?#13 = TVS: 台湾元基: SM712
FU?#6 FU?#7 = FUSE1: 保险
LED?#9 LED?#10 = Led: 发光二极管
R?#48-R?#76 = RES: 电阻
U?#14 U?#15 U?#18 U?#20 U?#22 = ISO3082DWR: 485隔离芯片
U?#16 U?#21 = B1205S-2W: 12V转5V电源隔离模块
U?#17 = B0505S-1WR2: 5V转5V电源隔离模块
U?#19 U?#24 = ADUM1201BR: Quad-Channel Digital Isolators; ADI(亚德诺): ADUM1201BRZ
U?#23 = ISO1540DR: I2C隔离芯片

## Sheet OTHER.SchDoc
size A4
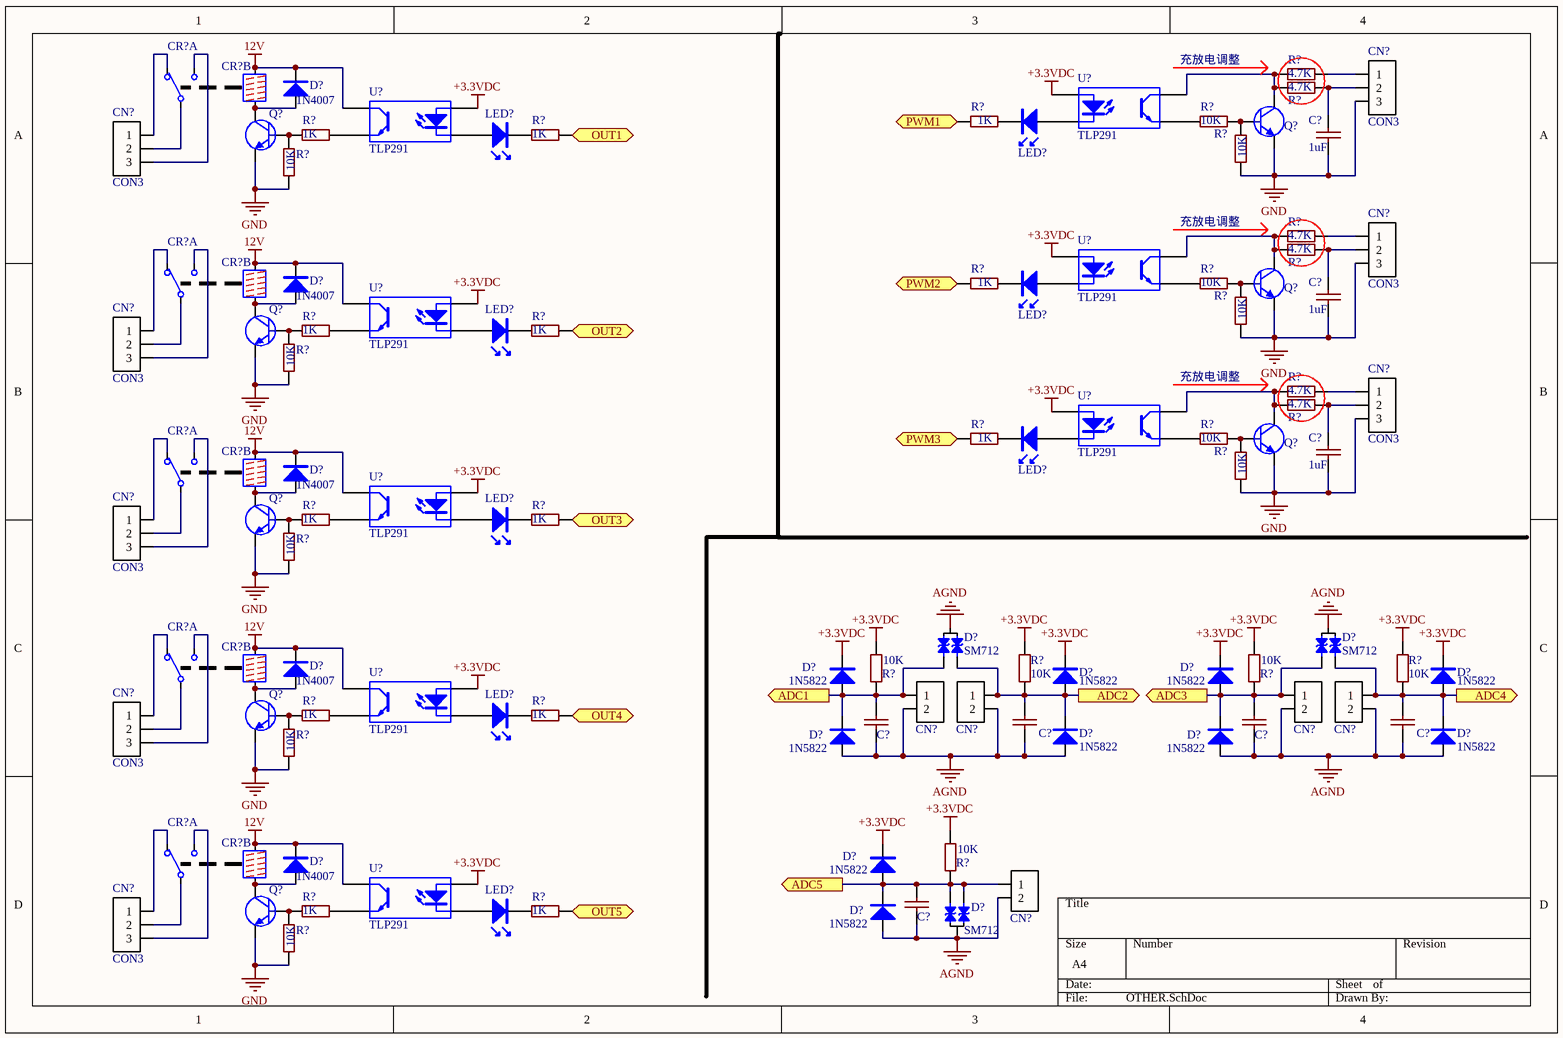
[diagram p3: OTHER.SchDoc]

### Parts
(Parts that share a designator on the sheet are numbered #1, #2 ... from top to bottom, then left to right.)
C?#63  1uF  [0603_C]
C?#64  1uF  [0603_C]
C?#65  1uF  [0603_C]
C?#66  CAP  [0603_C]  (value not drawn)
C?#67  CAP  [0603_C]  (value not drawn)
C?#68  CAP  [0603_C]  (value not drawn)
C?#69  CAP  [0603_C]  (value not drawn)
C?#70  CAP  [0603_C]  (value not drawn)
CN?#16  CON3  [WJ128V-3P]
CN?#17  CON3  [WJ128V-3P]
CN?#18  CON3  [WJ128V-3P]
CN?#19  CON3  [WJ128V-3P]
CN?#20  CON3  [WJ128V-3P]
CN?#21  CON3  [WJ128V-3P]
CN?#22  CON2  [HB9500-2P]  (value not drawn)
CN?#23  CON2  [HB9500-2P]  (value not drawn)
CN?#24  CON2  [HB9500-2P]  (value not drawn)
CN?#25  CON2  [HB9500-2P]  (value not drawn)
CN?#26  CON3  [WJ128V-3P]
CN?#27  CON2  [HB9500-2P]  (value not drawn)
CN?#28  CON3  [WJ128V-3P]
CR?#7  继电器  [G5Q-14]  (value not drawn)  (part A of 2)
CR?#8  继电器  [G5Q-14]  (value not drawn)  (part B of 2)
CR?#9  继电器  [G5Q-14]  (value not drawn)  (part A of 2)
CR?#10  继电器  [G5Q-14]  (value not drawn)  (part B of 2)
CR?#11  继电器  [G5Q-14]  (value not drawn)  (part A of 2)
CR?#12  继电器  [G5Q-14]  (value not drawn)  (part B of 2)
CR?#13  继电器  [G5Q-14]  (value not drawn)  (part A of 2)
CR?#14  继电器  [G5Q-14]  (value not drawn)  (part B of 2)
CR?#15  继电器  [G5Q-14]  (value not drawn)  (part A of 2)
CR?#16  继电器  [G5Q-14]  (value not drawn)  (part B of 2)
D?#14  1N4007  [MUR]
D?#15  1N4007  [MUR]
D?#16  1N4007  [MUR]
D?#17  SM712  [SOT-23]
D?#18  SM712  [SOT-23]
D?#19  1N4007  [MUR]
D?#20  1N5822  [MUR]
D?#21  1N5822  [MUR]
D?#22  1N5822  [MUR]
D?#23  1N5822  [MUR]
D?#24  1N5822  [MUR]
D?#25  1N5822  [MUR]
D?#26  1N5822  [MUR]
D?#27  1N5822  [MUR]
D?#28  1N4007  [MUR]
D?#29  1N5822  [MUR]
D?#30  SM712  [SOT-23]
D?#31  1N5822  [MUR]
LED?#11  Led  [0603_LED]  (value not drawn)
LED?#12  Led  [0603_LED]  (value not drawn)
LED?#13  Led  [0603_LED]  (value not drawn)
LED?#14  Led  [0603_LED]  (value not drawn)
LED?#15  Led  [0603_LED]  (value not drawn)
LED?#16  Led  [0603_LED]  (value not drawn)
LED?#17  Led  [0603_LED]  (value not drawn)
LED?#18  Led  [0603_LED]  (value not drawn)
Q?#10  1318  [SOT-23]  (value not drawn)
Q?#11  9013  [SOT-23]  (value not drawn)
Q?#12  1318  [SOT-23]  (value not drawn)
Q?#13  9013  [SOT-23]  (value not drawn)
Q?#14  1318  [SOT-23]  (value not drawn)
Q?#15  9013  [SOT-23]  (value not drawn)
Q?#16  9013  [SOT-23]  (value not drawn)
Q?#17  9013  [SOT-23]  (value not drawn)
R?#77  4.7K  [0603_R]
R?#78  4.7K  [0603_R]
R?#79  1K  [0603_R]
R?#80  10K  [0603_R]
R?#81  1K  [0603_R]
R?#82  1K  [0603_R]
R?#83  10K  [0603_R]
R?#84  10K  [0603_R]
R?#85  4.7K  [0603_R]
R?#86  4.7K  [0603_R]
R?#87  1K  [0603_R]
R?#88  10K  [0603_R]
R?#89  10K  [0603_R]
R?#90  1K  [0603_R]
R?#91  1K  [0603_R]
R?#92  10K  [0603_R]
R?#93  4.7K  [0603_R]
R?#94  4.7K  [0603_R]
R?#95  1K  [0603_R]
R?#96  10K  [0603_R]
R?#97  10K  [0603_R]
R?#98  1K  [0603_R]
R?#99  1K  [0603_R]
R?#100  10K  [0603_R]
R?#101  10K  [0603_R]
R?#102  10K  [0603_R]
R?#103  10K  [0603_R]
R?#104  10K  [0603_R]
R?#105  1K  [0603_R]
R?#106  1K  [0603_R]
R?#107  10K  [0603_R]
R?#108  10K  [0603_R]
R?#109  1K  [0603_R]
R?#110  1K  [0603_R]
R?#111  10K  [0603_R]
U?#25  TLP291  [sop-4]
U?#26  TLP291  [sop-4]
U?#27  TLP291  [sop-4]
U?#28  TLP291  [sop-4]
U?#29  TLP291  [sop-4]
U?#30  TLP291  [sop-4]
U?#31  TLP291  [sop-4]
U?#32  TLP291  [sop-4]

### Ports
ADC1 (out), ADC2 (out), ADC3 (out), ADC4 (out), ADC5 (out), OUT1 (in), OUT2 (in), OUT3 (in), OUT4 (in), OUT5 (in), PWM1 (in), PWM2 (in), PWM3 (in)

### Nets
12V: CR?#8.5 CR?#10.5 CR?#12.5 CR?#14.5 CR?#16.5 D?#14.K D?#15.K D?#16.K D?#19.K D?#28.K U?#26.4 U?#28.4 U?#30.4 U?#31.4 U?#32.4
+3.3VDC: D?#20.K D?#21.K D?#22.K D?#23.K D?#29.K R?#101.2 R?#102.2 R?#103.2 R?#104.2 R?#108.2 U?#25.1 U?#26.1 U?#27.1 U?#28.1 U?#29.1 U?#30.1 U?#31.1 U?#32.1
AGND: C?#66.2 C?#67.2 C?#68.2 C?#69.2 C?#70.2 CN?#22.2 CN?#23.2 CN?#24.2 CN?#25.2 CN?#27.2 D?#24.A D?#25.A D?#26.A D?#27.A D?#30.3 D?#31.A
GND: C?#63.2 C?#64.2 C?#65.2 CN?#16.3 CN?#18.3 CN?#20.3 Q?#10.2(E) Q?#11.2(E) Q?#12.2(E) Q?#13.2(E) Q?#14.2(E) Q?#15.2(E) Q?#16.2(E) Q?#17.2(E) R?#83.1 R?#84.1 R?#89.1 R?#92.1 R?#97.1 R?#100.1 R?#107.1 R?#111.1
NetC?#63_1: C?#63.1 CN?#16.2 R?#78.2
NetC?#64_1: C?#64.1 CN?#18.2 R?#86.2
NetC?#65_1: C?#65.1 CN?#20.2 R?#94.2
NetC?#66_1: C?#66.1 CN?#22.1 D?#17.2 D?#20.A D?#24.K R?#101.1 ; port ADC1
NetC?#67_1: C?#67.1 CN?#23.1 D?#17.1 D?#21.A D?#25.K R?#102.1 ; port ADC2
NetC?#68_1: C?#68.1 CN?#24.1 D?#18.2 D?#22.A D?#26.K R?#103.1 ; port ADC3
NetC?#69_1: C?#69.1 CN?#25.1 D?#18.1 D?#23.A D?#27.K R?#104.1 ; port ADC4
NetC?#70_1: C?#70.1 CN?#27.1 D?#29.A D?#30.1 D?#30.2 D?#31.K R?#108.1 ; port ADC5
NetCN?#16_1: CN?#16.1 R?#77.2
NetCN?#17_1: CN?#17.1 CR?#7.2
NetCN?#17_2: CN?#17.2 CR?#7.4
NetCN?#17_3: CN?#17.3 CR?#7.3
NetCN?#18_1: CN?#18.1 R?#85.2
NetCN?#19_1: CN?#19.1 CR?#9.2
NetCN?#19_2: CN?#19.2 CR?#9.4
NetCN?#19_3: CN?#19.3 CR?#9.3
NetCN?#20_1: CN?#20.1 R?#93.2
NetCN?#21_1: CN?#21.1 CR?#11.2
NetCN?#21_2: CN?#21.2 CR?#11.4
NetCN?#21_3: CN?#21.3 CR?#11.3
NetCN?#26_1: CN?#26.1 CR?#13.2
NetCN?#26_2: CN?#26.2 CR?#13.4
NetCN?#26_3: CN?#26.3 CR?#13.3
NetCN?#28_1: CN?#28.1 CR?#15.2
NetCN?#28_2: CN?#28.2 CR?#15.4
NetCN?#28_3: CN?#28.3 CR?#15.3
NetCR?#8_1: CR?#8.1 D?#14.A Q?#11.3(C)
NetCR?#10_1: CR?#10.1 D?#15.A Q?#13.3(C)
NetCR?#12_1: CR?#12.1 D?#16.A Q?#15.3(C)
NetCR?#14_1: CR?#14.1 D?#19.A Q?#16.3(C)
NetCR?#16_1: CR?#16.1 D?#28.A Q?#17.3(C)
NetLED?#11_A: LED?#11.A U?#25.2
NetLED?#11_K: LED?#11.K R?#79.1
NetLED?#12_A: LED?#12.A U?#26.2
NetLED?#12_K: LED?#12.K R?#82.1
NetLED?#13_A: LED?#13.A U?#27.2
NetLED?#13_K: LED?#13.K R?#87.1
NetLED?#14_A: LED?#14.A U?#28.2
NetLED?#14_K: LED?#14.K R?#91.1
NetLED?#15_A: LED?#15.A U?#29.2
NetLED?#15_K: LED?#15.K R?#95.1
NetLED?#16_A: LED?#16.A U?#30.2
NetLED?#16_K: LED?#16.K R?#99.1
NetLED?#17_A: LED?#17.A U?#31.2
NetLED?#17_K: LED?#17.K R?#106.1
NetLED?#18_A: LED?#18.A U?#32.2
NetLED?#18_K: LED?#18.K R?#110.1
NetQ?#10_1: Q?#10.1(B) R?#80.2 R?#83.2
NetQ?#10_3: Q?#10.3(C) R?#77.1 R?#78.1 U?#25.4
NetQ?#11_1: Q?#11.1(B) R?#81.2 R?#84.2
NetQ?#12_1: Q?#12.1(B) R?#88.2 R?#89.2
NetQ?#12_3: Q?#12.3(C) R?#85.1 R?#86.1 U?#27.4
NetQ?#13_1: Q?#13.1(B) R?#90.2 R?#92.2
NetQ?#14_1: Q?#14.1(B) R?#96.2 R?#97.2
NetQ?#14_3: Q?#14.3(C) R?#93.1 R?#94.1 U?#29.4
NetQ?#15_1: Q?#15.1(B) R?#98.2 R?#100.2
NetQ?#16_1: Q?#16.1(B) R?#105.2 R?#107.2
NetQ?#17_1: Q?#17.1(B) R?#109.2 R?#111.2
NetR?#79_2: R?#79.2 ; port PWM1
NetR?#80_1: R?#80.1 U?#25.3
NetR?#81_1: R?#81.1 U?#26.3
NetR?#82_2: R?#82.2 ; port OUT1
NetR?#87_2: R?#87.2 ; port PWM2
NetR?#88_1: R?#88.1 U?#27.3
NetR?#90_1: R?#90.1 U?#28.3
NetR?#91_2: R?#91.2 ; port OUT2
NetR?#95_2: R?#95.2 ; port PWM3
NetR?#96_1: R?#96.1 U?#29.3
NetR?#98_1: R?#98.1 U?#30.3
NetR?#99_2: R?#99.2 ; port OUT3
NetR?#105_1: R?#105.1 U?#31.3
NetR?#106_2: R?#106.2 ; port OUT4
NetR?#109_1: R?#109.1 U?#32.3
NetR?#110_2: R?#110.2 ; port OUT5

Not connected (* = marked no-connect by the designer): D?#17 3; D?#18 3

### Notes on the sheet
- 充放电调整
- Labels drawn without touching a wire or pin: AGND

### Library data of the parts
C?#63-C?#70 = CAP: as C?#28 on sheet POWER
CN?#16-CN?#21 CN?#26 CN?#28 = CON3: 连接器
CN?#22-CN?#25 CN?#27 = CON2: 连接器; KANGNEX(康奈克斯电气): HB9500-2P 黑色
D?#14-D?#16 D?#19-D?#29 D?#31 = DIODE: 二极管
D?#17 D?#18 D?#30 = TVS: 台湾元基: SM712
LED?#11-LED?#18 = Led: 发光二极管
Q?#10-Q?#17 = NPN: 三极管
R?#77-R?#111 = RES: 电阻
CR?#7-CR?#16 = 继电器: Published: 24-Mar-1999; LatestRevisionDate: 17-Jul-2002; LatestRevisionNote: Re-released for DXP Platform.; PackageReference: DIP-P8; Publisher: Altium Limited

## Nets that join several sheets
3.3V: MCU (43 pins), POWER (5 pins)
5V: POWER (C?#36.1 L?#3.2 U?#10.4), COMM (8 pins)
12V: POWER (9 pins), COMM (CN?#10.1), OTHER (15 pins)
+3.3VDC: POWER (7 pins), COMM (20 pins), OTHER (18 pins)
AGND: MCU (8 pins), OTHER (16 pins)
GND: POWER (17 pins), COMM (16 pins), OTHER (22 pins)
SGND: MCU (41 pins), POWER (15 pins), COMM (22 pins)
NetC?#66_1: MCU (U?#1.15), OTHER (6 pins)
NetC?#67_1: MCU (U?#1.16), OTHER (6 pins)
NetC?#68_1: MCU (U?#1.17), OTHER (6 pins)
NetC?#69_1: MCU (U?#1.18), OTHER (6 pins)
NetC?#70_1: MCU (U?#2.8), OTHER (7 pins)
NetLED?#9_K: MCU (U?#1.48), COMM (LED?#9.K U?#19.2)
NetLED?#10_K: MCU (U?#1.79), COMM (LED?#10.K U?#24.2)
NetR?#22_1: MCU (U?#1.44), POWER (R?#22.1)
NetR?#25_1: MCU (U?#1.45), POWER (R?#25.1)
NetR?#28_1: MCU (U?#1.46), POWER (R?#28.1)
NetR?#31_1: MCU (U?#1.4), POWER (R?#31.1)
NetR?#36_1: MCU (U?#1.38), POWER (R?#36.1)
NetR?#37_1: MCU (U?#1.5), POWER (R?#37.1)
NetR?#43_1: MCU (U?#2.59), POWER (R?#43.1)
NetR?#68_1: MCU (U?#1.91), COMM (R?#68.1 U?#23.7)
NetR?#69_1: MCU (U?#1.92), COMM (R?#69.1 U?#23.6)
NetR?#79_2: MCU (U?#1.93), OTHER (R?#79.2)
NetR?#82_2: MCU (U?#1.39), OTHER (R?#82.2)
NetR?#87_2: MCU (U?#1.95), OTHER (R?#87.2)
NetR?#91_2: MCU (U?#1.40), OTHER (R?#91.2)
NetR?#95_2: MCU (U?#1.96), OTHER (R?#95.2)
NetR?#99_2: MCU (U?#1.41), OTHER (R?#99.2)
NetR?#106_2: MCU (U?#1.42), OTHER (R?#106.2)
NetR?#110_2: MCU (U?#1.43), OTHER (R?#110.2)
NetU?#1_1: MCU (U?#1.1), COMM (U?#22.4 U?#22.5)
NetU?#1_2: MCU (U?#1.2), COMM (U?#14.4 U?#14.5)
NetU?#1_3: MCU (U?#1.3), COMM (U?#15.4 U?#15.5)
NetU?#1_25: MCU (U?#1.25), COMM (U?#15.6)
NetU?#1_26: MCU (U?#1.26), COMM (U?#15.3)
NetU?#1_47: MCU (U?#1.47), COMM (U?#19.3)
NetU?#1_68: MCU (U?#1.68), COMM (U?#14.6)
NetU?#1_69: MCU (U?#1.69), COMM (U?#14.3)
NetU?#1_78: MCU (U?#1.78), COMM (U?#24.3)
NetU?#1_97: MCU (U?#1.97), COMM (U?#18.4 U?#18.5)
NetU?#1_98: MCU (U?#1.98), COMM (U?#20.4 U?#20.5)
NetU?#2_16: MCU (U?#2.16), COMM (U?#20.6)
NetU?#2_17: MCU (U?#2.17), COMM (U?#20.3)
NetU?#2_29: MCU (U?#2.29), COMM (U?#22.6)
NetU?#2_30: MCU (U?#2.30), COMM (U?#22.3)
NetU?#2_42: MCU (U?#2.42), COMM (U?#18.6)
NetU?#2_43: MCU (U?#2.43), COMM (U?#18.3)